# Altium schematic sheet ESP32.SchDoc
size A4; DrawnBy: Emile Renaud; Revision: V1.0; SheetNumber: 2; SheetTotal: 5
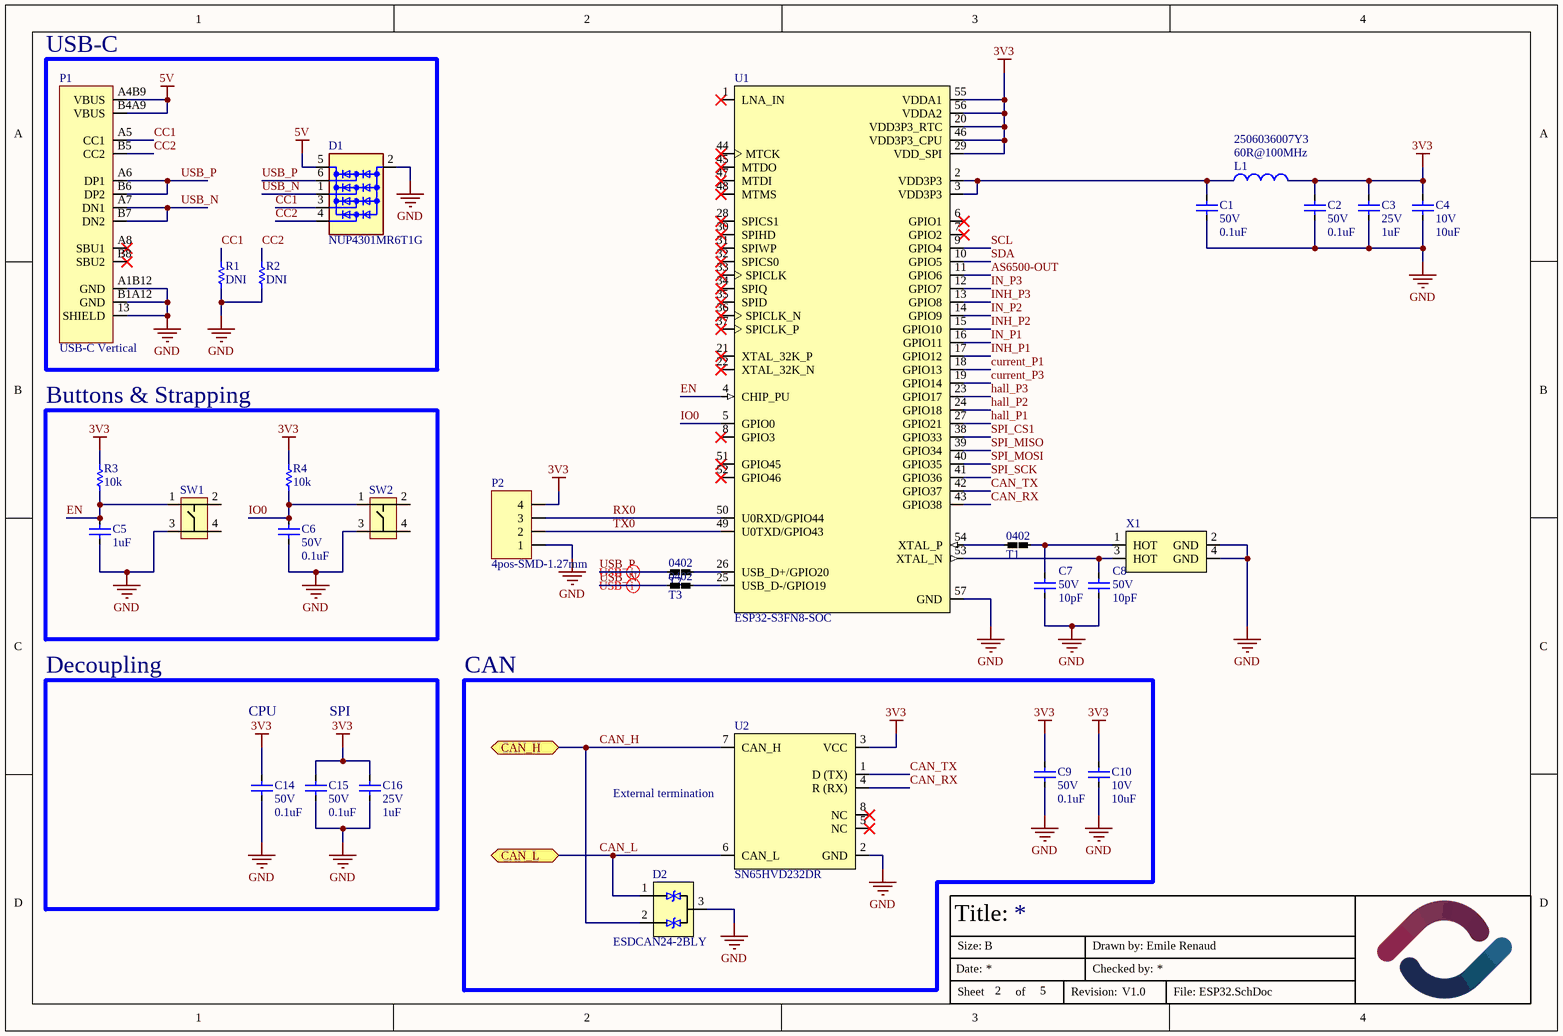
[diagram p0: ESP32.SchDoc]

## Parts
C1  value 0.1uF  Volt: 50V  [CAPACITOR-0603]  (hidden comment: Capacitor-0603-0.1uF-50V-X7R)
C2  value 0.1uF  Volt: 50V  [CAPACITOR-0603]  (hidden comment: Capacitor-0603-0.1uF-50V-X7R)
C3  value 1uF  Volt: 25V  [CAPACITOR-0603]  (hidden comment: Capacitor-0603-1uF-25V-X5R)
C4  value 10uF  Volt: 10V  [CAPACITOR-0603]  (hidden comment: Capacitor-0603-10uF-10V-X5R)
C5  value 1uF  [CAPACITOR-0603]  (hidden comment: Capacitor-0603-1uF-25V-X5R)
C6  value 0.1uF  Volt: 50V  [CAPACITOR-0603]  (hidden comment: Capacitor-0603-0.1uF-50V-X7R)
C7  value 10pF  Volt: 50V  [CAPACITOR-0402]  (hidden comment: Capacitor-0402-10pF-50V-C0G)
C8  value 10pF  Volt: 50V  [CAPACITOR-0402]  (hidden comment: Capacitor-0402-10pF-50V-C0G)
C9  value 0.1uF  Volt: 50V  [CAPACITOR-0603]  (hidden comment: Capacitor-0603-0.1uF-50V-X7R)
C10  value 10uF  Volt: 10V  [CAPACITOR-0603]  (hidden comment: Capacitor-0603-10uF-10V-X5R)
C14  value 0.1uF  Volt: 50V  [CAPACITOR-0603]  (hidden comment: Capacitor-0603-0.1uF-50V-X7R)
C15  value 0.1uF  Volt: 50V  [CAPACITOR-0603]  (hidden comment: Capacitor-0603-0.1uF-50V-X7R)
C16  value 1uF  Volt: 25V  [CAPACITOR-0603]  (hidden comment: Capacitor-0603-1uF-25V-X5R)
D1  NUP4301MR6T1G  [SOT-23-6]
D2  ESDCAN24-2BLY  [SOT-23-3]
L1  2506036007Y3  value 60R@100MHz  [CAPACITOR-0603]
P1  USB-C Vertical  [GCT_USB4145-03-0230-C_REVA2]
P2  4pos-SMD-1.27mm  [HDR1X4-SMD-50mils]
R1  value DNI  [RESISTOR-0603]  (hidden comment: Resistor-0603-5.1k)
R2  value DNI  [RESISTOR-0603]  (hidden comment: Resistor-0603-5.1k)
R3  value 10k  [Resistor-0603]  (hidden comment: SMT resistor)
R4  value 10k  [Resistor-0603]  (hidden comment: SMT resistor)
SW1  PTS815 SJM 250 SMTR LFS  [SW4_PTS815 SJM 250 SMTR LFS_CNK]  (value not drawn)
SW2  PTS815 SJM 250 SMTR LFS  [SW4_PTS815 SJM 250 SMTR LFS_CNK]  (value not drawn)
T1  NetTie_0402  [NetTie-0402]  (value not drawn)
T2  NetTie_0402  [NetTie-0402]  (value not drawn)
T3  NetTie_0402  [NetTie-0402]  (value not drawn)
U1  ESP32-S3FN8-SOC  [VFQFN-56 Exposed Pad]
U2  SN65HVD232DR  [SOIC-8]
X1  CX2016DB40000D0FLJCC  [4-SMD]  (value not drawn)

## Blocks framed on the sheet
USB-C: D1 P1 R1 R2
Buttons & Strapping: C5 C6 R3 R4 SW1 SW2
Decoupling: C14-C16
CAN: C9 C10 D2 U2

## Ports
CAN_H (bidir, see Power[1D]), CAN_L (bidir, see Power[1D])

## Nets
3V3: C2.2 C3.2 C4.2 C9.2 C10.2 C14.2 C15.2 C16.2 L1.2 P2.4 R3.2 R4.2 U1.20(VDD3P3_RTC) U1.29(VDD_SPI) U1.46(VDD3P3_CPU) U1.55(VDDA1) U1.56(VDDA2) U2.3(VCC)
5V: D1.5(VDD) P1.A4B9(VBUS) P1.B4A9(VBUS)
GND: C1.1 C2.1 C3.1 C4.1 C5.1 C6.1 C7.1 C8.1 C9.1 C10.1 C14.1 C15.1 C16.1 D1.2(GND) D2.3(L3) P1.13(SHIELD) P1.A1B12(GND) P1.B1A12(GND) P2.1 R1.1 R2.1 SW1.3 SW2.3 U1.57(GND) U2.2(GND) X1.2(GND) X1.4(GND)
AS6500-OUT: U1.11(GPIO6)
CAN_H: D2.2(GND) U2.7(CAN_H) ; port CAN_H
CAN_L: D2.1(L2) U2.6(CAN_L) ; port CAN_L
CAN_RX: U1.43(GPIO38) U2.4(R_(RX))
CAN_TX: U1.42(GPIO37) U2.1(D_(TX))
CC1: D1.3(L3) P1.A5(CC1) R1.2
CC2: D1.4(L4) P1.B5(CC2) R2.2
current_P1: U1.18(GPIO13)
current_P3: U1.19(GPIO14)
EN: C5.2 R3.1 SW1.1 U1.4(CHIP_PU)
hall_P1: U1.27(GPIO21)
hall_P2: U1.24(GPIO18)
hall_P3: U1.23(GPIO17)
IN_P1: U1.16(GPIO11)
IN_P2: U1.14(GPIO9)
IN_P3: U1.12(GPIO7)
INH_P1: U1.17(GPIO12)
INH_P2: U1.15(GPIO10)
INH_P3: U1.13(GPIO8)
IO0: C6.2 R4.1 SW2.1 U1.5(GPIO0)
RX0: P2.3 U1.50(U0RXD/GPIO44)
SCL: U1.9(GPIO4)
SDA: U1.10(GPIO5)
SPI_CS1: U1.38(GPIO33)
SPI_MISO: U1.39(GPIO34)
SPI_MOSI: U1.40(GPIO35)
SPI_SCK: U1.41(GPIO36)
TX0: P2.2 U1.49(U0TXD/GPIO43)
USB_N: D1.1(L2) P1.A7(DN1) P1.B7(DN2) T3.2
USB_P: D1.6(L1) P1.A6(DP1) P1.B6(DP2) T2.2
NetC1_2: C1.2 L1.1 U1.2(VDD3P3) U1.3(VDD3P3)
NetC7_2: C7.2 T1.1 X1.1(HOT)
NetC8_2: C8.2 U1.53(XTAL_N) X1.3(HOT)
NetT1_2: T1.2 U1.54(XTAL_P)
NetT2_1: T2.1 U1.26(USB_D+/GPIO20)
NetT3_1: T3.1 U1.25(USB_D-/GPIO19)

Not connected (* = marked no-connect by the designer): P1 A8(SBU1)* B8(SBU2)*; SW1 2 4; SW2 2 4; U1 1(LNA_IN)* 6(GPIO1)* 7(GPIO2)* 8(GPIO3)* 21(XTAL_32K_P)* 22(XTAL_32K_N)* 28(SPICS1)* 30(SPIHD)* 31(SPIWP)* 32(SPICS0)* 33(SPICLK)* 34(SPIQ)* 35(SPID)* 36(SPICLK_N)* 37(SPICLK_P)* 44(MTCK)* 45(MTDO)* 47(MTDI)* 48(MTMS)* 51(GPIO45)* 52(GPIO46)*; U2 5(NC)* 8(NC)*

## Layout directives
differential pair; differential pair class USB: USB_N, USB_P

## Notes on the sheet
- CPU
- SPI
- (near U2) External termination
- Title:
- Date:
- Size:
- B
- Drawn by:
- Checked by:
- Sheet
- of
- Revision:
- File:
- (in symbol NetTie_0402) 0402

## Library data of the parts
C1 C2 C6 C9 C14 C15 = Capacitor-0603-0.1uF-50V-X7R: Precision: X7R-10%; Package / Case: Metric 1608, EIA 0603; Mounted: Yes; Supplier 1: Digi-Key; Supplier Part Number 1: 1276-1935-2-ND; Supplier 2: Digi-Key; Supplier Part Number 2: 1276-1934-2-ND
C3 C16 = Capacitor-0603-1uF-25V-X5R: Precision: X5R-10%; Package / Case: Metric 1608, EIA 0603; Mounted: Yes; Supplier 1: Digi-Key; Supplier Part Number 1: 1276-1859-2-ND; Supplier 2: Digi-Key; Supplier Part Number 2: 1276-1942-2-ND
C4 C10 = Capacitor-0603-10uF-10V-X5R: 10 µF ±20% 10V Ceramic Capacitor X5R 0603 (1608 Metric); Supplier 1: Digikey; Supplier Part Number 1: 4713-GMC10X5R106M10NTCT-ND; Mounted: Yes; Package / Case: Metric 1608 , EIA 0603; Precision: 20%
C5 = Capacitor-0603-1uF-25V-X5R: Precision: X5R-10%; Volt: 25V; Package / Case: Metric 1608, EIA 0603; Mounted: Yes; Supplier 1: Digi-Key; Supplier Part Number 1: 1276-1859-2-ND; Supplier 2: Digi-Key; Supplier Part Number 2: 1276-1942-2-ND
C7 C8 = Capacitor-0402-10pF-50V-C0G: Precision: C0G - 10%; Package / Case: 0402 (1005 Metric); Mounted: Yes; Supplier 1: Digi-Key; Supplier Part Number 1: 399-C0402C100K5GAC7867CT-ND; Supplier 2: Digi-Key; HelpURL: https://connect.kemet.com:7667/gateway/IntelliData-ComponentDocumentation/1.0/download/datasheet/C0402C100K5GACTU
D1 = NUP4301MR6T1G: 4CH Clamp Ipp Tvs Diode Surface Mount SOT23-6 (SC74); Volt: 70; Supplier 1: Digi-Key; Supplier Part Number 1: NUP4301MR6T1GOSTR-ND; Mounted: Yes; Package / Case: SOT23-6
D2 = ESDCAN24-2BLY: 55V Clamp 6A (8/20µs) Ipp Tvs Diode Surface Mount SOT-23; Volt: 24; Supplier 1: Digi-Key; Supplier Part Number 1: 5272-ESDCAN24-2BLYCT-ND; Mounted: Yes; Package / Case: SOT-23-3
L1 = 2506036007Y3: 60 Ohms @ 100 MHz 1 Signal Line Ferrite Bead 0603 (1608 Metric) 3A 40mOhm; Supplier 1: Digi-Key; Mounted: Yes; Supplier Part Number 1: 1934-1396-1-ND; Package / Case: SMD; Current: 3A
P1 = USB-C Vertical: USB4145-03-0230-C / 5A USB USB 2.0 Receptacle; Supplier 1: Digikey; Supplier Part Number 1: 2073-USB4145-03-0230-CCT-ND; Mounted: Yes; Package / Case: SMD; Volt: N/A
P2 = 4pos-SMD-1.27mm: 4pos SMD 1.27mm; Supplier 1: Digi-Key; Supplier Part Number 1: N/A; Mounted: Yes; Package / Case: TH; Volt: N/A
R1 R2 = Resistor-0603-DNI: 0603 footprint DO NOT INSTALL; Mounted: Yes; Package/Case: Metric 1608 , EIA 0603
R3 R4 = Resistor0603-10k: Precision: 1%; Watt: 0.1W; Mounted: Yes; Package / Case: Metric 1608, EIA 0603; Supplier 2: Digi-Key; Supplier 4: Digi-Key; Supplier Part Number 2: RMCF0603FT10K0TR-ND; Supplier 1: Digi-Key; Supplier 3: Digi-Key; Supplier Part Number 1: 311-10.0KHRTR-ND
SW1 SW2 = PTS815 SJM 250 SMTR LFS: TACT 4.2 X 3.2, 2.5 MM H, 180GF,; Volt: 12V; Current: 0.05A; Supplier 1: Digi-Key; Supplier Part Number 1: CKN12215-1-ND; Mounted: Yes
U1 = ESP32-S3FN8-SOC: IC RF TxRx + MCU Bluetooth, WiFi 802.11b/g/n, Bluetooth v5.0 2.412GHz ~ 2.484GHz 56-VFQFN Exposed Pad; MF: Espressif Systems; Availability: In Stock; MP: ESP32-S3FN8; Package: 56-VFQFN Exposed Pad; DigiKey Link: https://www.digikey.ca/en/products/detail/espressif-systems/ESP32-S3FN8/15822446; HelpURL: https://www.espressif.com/sites/default/files/documentation/esp32-s3_datasheet_en.pdf; Supplier 1: Digikey; Supplier Part Number 1: 1965-ESP32-S3FN8-ND
U2 = SN65HVD232DR: 1/1 Transceiver Half CANbus 8-SOIC; Package / Case: 8-SOIC; Mounted: Yes; Supplier 1: Digikey; Supplier Part Number 1: 296-26344-1-ND; HelpURL: https://www.ti.com/lit/ds/symlink/sn65hvd230.pdf?HQS=dis-dk-null-digikeymode-dsf-pf-null-wwe&ts=1723930967656&ref_url=https%253A%252F%252Fwww.ti.com%252Fgeneral%252Fdocs%252Fsuppproductinfo.tsp%253FdistId%253D10%2526gotoUrl%253Dhttps%253A%252F%252Fwww.ti.com%252Flit%252Fgpn%252Fsn65hvd230
X1 = CX2016DB40000D0FLJCC: 40 MHz ±10ppm Crystal 8pF 50 Ohms 4-SMD, No Lead; Supplier 1: Digikey; Supplier Part Number 1: 478-CX2016DB40000D0FLJCCCT-ND; Parameter 1: *